# Altium project Reflow.PrjPcb
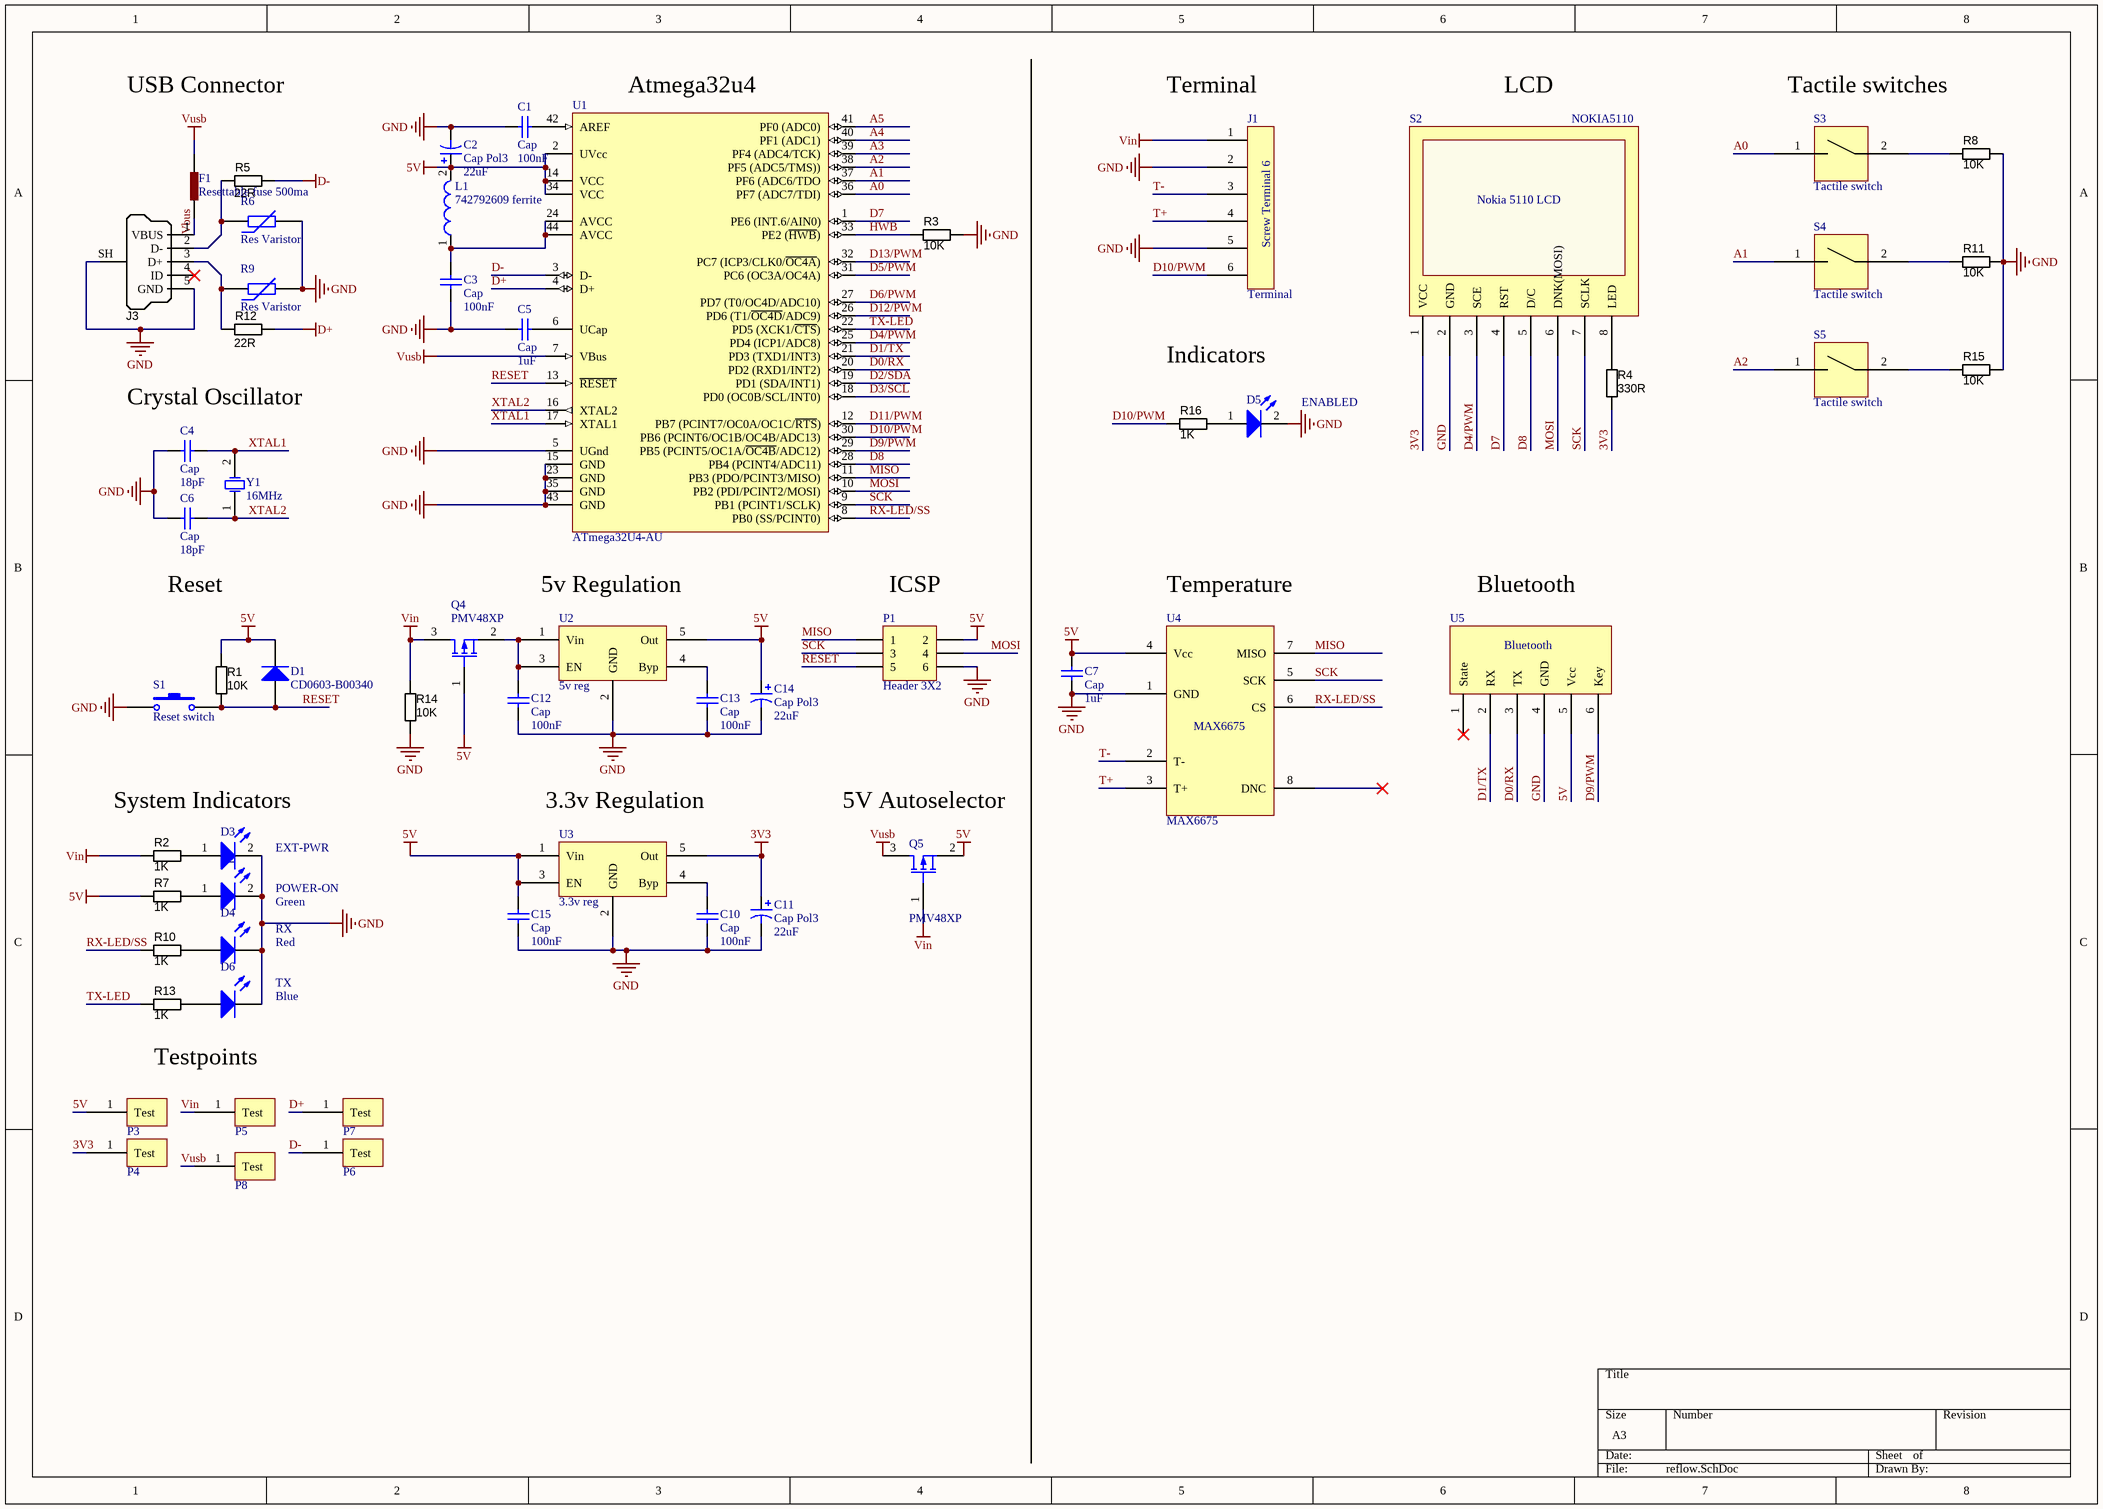
[diagram p0: reflow.SchDoc]
1 sheet, 59 parts. Net scope: global (net labels, ports and power ports of the same name join across sheets).
Board file: reflow.PcbDoc

## Sheet reflow.SchDoc
size A3

### Parts
C1  Cap  value 100nF  [CAP-0603-GEN]
C2  Cap Pol3  value 22uF  [CAP-0603-POL]
C3  Cap  value 100nF  [CAP-0603-GEN]
C4  Cap  value 18pF  [CAP-0603-GEN]
C5  Cap  value 1uF  [CAP-0603-GEN]
C6  Cap  value 18pF  [CAP-0603-GEN]
C7  Cap  value 1uF  [CAP-0603-GEN]
C10  Cap  value 100nF  [CAP-0603-GEN]
C11  Cap Pol3  value 22uF  [CAP-0603-POL]
C12  Cap  value 100nF  [CAP-0603-GEN]
C13  Cap  value 100nF  [CAP-0603-GEN]
C14  Cap Pol3  value 22uF  [CAP-0603-POL]
C15  Cap  value 100nF  [CAP-0603-GEN]
D1  CD0603-B00340  [DIODE-0603]
D2  POWER-ON  [LED-0603]
D3  EXT-PWR  [LED-0603]
D4  RX  [LED-0603]
D5  ENABLED  [LED-0603]
D6  TX  [LED-0603]
F1  Resettable fuse 500ma  [FUSE-0603]
J1  Terminal  [HEADER-3x2-RIGHT]
J3  USB Micro Type B (recommended if hand soldering)  [USB-MICRO-B]  (value not drawn)
L1  742792609 ferrite  [CAP-0603-GEN]
P1  Header 3X2  [TAG-CONNECT]
P3  TESTPOINT  [Testpoint]  (value not drawn)
P4  TESTPOINT  [Testpoint]  (value not drawn)
P5  TESTPOINT  [Testpoint]  (value not drawn)
P6  TESTPOINT  [Testpoint]  (value not drawn)
P7  TESTPOINT  [Testpoint]  (value not drawn)
P8  TESTPOINT  [Testpoint]  (value not drawn)
Q4  PMV48XP  [SOT23-3]
Q5  PMV48XP  [SOT23-3]
R1  value 10K  [RES-0603]  (hidden comment: Thick Film)
R2  value 1K  [RES-0603]  (hidden comment: Thick Film)
R3  value 10K  [RES-0603]  (hidden comment: Thick Film)
R4  value 330R  [RES-0603]  (hidden comment: Thick Film)
R5  value 22R  [RES-0603]  (hidden comment: Thick Film)
R6  Res Varistor  [RES-0603]
R7  value 1K  [RES-0603]  (hidden comment: Thick Film)
R8  value 10K  [RES-0603]  (hidden comment: Thick Film)
R9  Res Varistor  [RES-0603]
R10  value 1K  [RES-0603]  (hidden comment: Thick Film)
R11  value 10K  [RES-0603]  (hidden comment: Thick Film)
R12  value 22R  [RES-0603]  (hidden comment: Thick Film)
R13  value 1K  [RES-0603]  (hidden comment: Thick Film)
R14  value 10K  [RES-0603]  (hidden comment: Thick Film)
R15  value 10K  [RES-0603]  (hidden comment: Thick Film)
R16  value 1K  [RES-0603]  (hidden comment: Thick Film)
S1  Reset switch  [TACTILE-SWITCH]
S2  NOKIA5110  [NOKIA5110]
S3  Tactile switch  [TACTILE-SWITCH]
S4  Tactile switch  [TACTILE-SWITCH]
S5  Tactile switch  [TACTILE-SWITCH]
U1  ATmega32U4-AU  [44ML_N]
U2  5v reg  [SOT23-5]
U3  3.3v reg  [SOT23-5]
U4  MAX6675  [SO8_N]
U5  Bluetooth module  [BLUETOOTH-MODULE]  (value not drawn)
Y1  16MHz  [XTAL-5032]

### Nets
3V3: C11.1 P4.1(Test) R4.2 S2.1(VCC) U3.5(Out)
5V: C2.1 C7.2 C14.1 C15.2 D1.2(K) L1.2 P1.2 P3.1(Test) Q4.1(S) Q5.2(D) R1.2 R7.2 U1.2(UVcc) U1.14(VCC) U1.34(VCC) U2.5(Out) U3.1(Vin) U3.3(EN) U4.4(Vcc) U5.5(Vcc)
D+: P7.1(Test) R12.2 U1.4(D+)
D-: P6.1(Test) R5.2 U1.3(D-)
GND: C1.2 C2.2 C3.1 C4.2 C5.2 C6.2 C7.1 C10.1 C11.2 C12.1 C13.1 C14.2 C15.1 D2.2(K) D3.2(K) D4.2(K) D5.2(K) D6.2(K) J1.2 J1.5 J3.5(GND) J3.SH(Shell) P1.6 R3.1 R6.2 R8.1 R9.2 R11.1 R14.2 R15.1 S1.1 S2.2(GND) U1.5(UGnd) U1.15(GND) U1.23(GND) U1.35(GND) U1.43(GND) U2.2(GND) U3.2(GND) U4.1(GND) U5.4(GND)
Vin: J1.1 P5.1(Test) Q4.3(G) Q5.1(S) R2.2 R14.1
Vusb: F1.0 P8.1(Test) Q5.3(G) U1.7(VBus)
A0: S3.1 U1.36(PF7_(ADC7/TDI))
A1: S4.1 U1.37(PF6_(ADC6/TDO)
A2: S5.1 U1.38(PF5_(ADC5/TMS)))
A3: U1.39(PF4_(ADC4/TCK))
A4: U1.40(PF1_(ADC1))
A5: U1.41(PF0_(ADC0))
D0/RX: U1.20(PD2_(RXD1/INT2)) U5.3(TX)
D1/TX: U1.21(PD3_(TXD1/INT3)) U5.2(RX)
D2/SDA: U1.19(PD1_(SDA/INT1))
D3/SCL: U1.18(PD0_(OC0B/SCL/INT0))
D4/PWM: S2.3(SCE) U1.25(PD4_(ICP1/ADC8))
D5/PWM: U1.31(PC6_(OC3A/OC4A))
D6/PWM: U1.27(PD7_(T0/OC4D/ADC10))
D7: S2.4(RST) U1.1(PE6_(INT.6/AIN0))
D8: S2.5(D/C) U1.28(PB4_(PCINT4/ADC11))
D9/PWM: U1.29(PB5_(PCINT5/OC1A/~{OC4B}/ADC12)) U5.6(Key)
D10/PWM: J1.6 R16.2 U1.30(PB6_(PCINT6/OC1B/OC4B/ADC13))
D11/PWM: U1.12(PB7_(PCINT7/OC0A/OC1C/~{RTS}))
D12/PWM: U1.26(PD6_(T1/~{OC4D}/ADC9))
D13/PWM: U1.32(PC7_(ICP3/CLK0/~{OC4A}))
HWB: R3.2 U1.33(PE2_(~{HWB}))
MISO: P1.1 U1.11(PB3_(PDO/PCINT3/MISO)) U4.7(MISO)
MOSI: P1.4 S2.6(DNK(MOSI)) U1.10(PB2_(PDI/PCINT2/MOSI))
RESET: D1.1(A) P1.5 R1.1 S1.2 U1.13(~{RESET})
RX-LED/SS: R10.2 U1.8(PB0_(SS/PCINT0)) U4.6(CS)
SCK: P1.3 S2.7(SCLK) U1.9(PB1_(PCINT1/SCLK)) U4.5(SCK)
T+: J1.4 U4.3(T+)
T-: J1.3 U4.2(T-)
TX-LED: R13.2 U1.22(PD5_(XCK1/~{CTS}))
Vbus: F1.1 J3.1(VBUS)
XTAL1: C4.1 U1.17(XTAL1) Y1.2(OSC2)
XTAL2: C6.1 U1.16(XTAL2) Y1.1(OSC1)
NetC1_1: C1.1 U1.42(AREF)
NetC3_2: C3.2 L1.1 U1.24(AVCC) U1.44(AVCC)
NetC5_1: C5.1 U1.6(UCap)
NetC10_2: C10.2 U3.4(Byp)
NetC12_2: C12.2 Q4.2(D) U2.1(Vin) U2.3(EN)
NetC13_2: C13.2 U2.4(Byp)
NetD2_1: D2.1(A) R7.1
NetD3_1: D3.1(A) R2.1
NetD4_1: D4.1(A) R10.1
NetD5_1: D5.1(A) R16.1
NetD6_1: D6.1(A) R13.1
NetJ3_2: J3.2(D-) R5.1 R6.1
NetJ3_3: J3.3(D+) R9.1 R12.1
NetR4_1: R4.1 S2.8(LED)
NetR8_2: R8.2 S3.2
NetR11_2: R11.2 S4.2
NetR15_2: R15.2 S5.2

Not connected (* = marked no-connect by the designer): J3 4(ID)*; U4 8(DNC)*; U5 1(State)*

### Notes on the sheet
- USB Connector
- (near U1) Atmega32u4
- (near J1) Terminal
- LCD
- Tactile switches
- Indicators
- Crystal Oscillator
- Reset
- 5v Regulation
- (near P1) ICSP
- Temperature
- Bluetooth
- System Indicators
- (near U3) 3.3v Regulation
- (near Q5) 5V Autoselector
- Green
- Red
- Blue
- Testpoints
- (in symbol BLUETOOTH-MODULE) Bluetooth
- (in symbol NOKIA5110) Nokia 5110 LCD
- (in symbol SCREW-TERMINAL-6) Screw Terminal 6

### Library data of the parts
C1 C3-C7 C10 C12 C13 C15 = Cap: Capacitor; Published: 8-Jun-2000; LatestRevisionDate: 17-Jul-2002; LatestRevisionNote: Re-released for DXP Platform.; PackageReference: RAD-0.3; Publisher: Altium Limited; PackageDescription: Radial Cap, Thru-Hole; 2 Leads; 0.3 in Pin Spacing
C2 C11 C14 = Cap Pol3: Polarized Capacitor (Surface Mount); Published: 8-Jun-2000; LatestRevisionDate: 29-May-2009; LatestRevisionNote: IPC-7351 Footprint Added.; PackageReference: C0805; Publisher: Altium Limited; PackageDescription: Chip Capacitor
D1 = Diode: Default Diode; Published: 8-Jun-2000; LatestRevisionDate: 17-Jul-2002; LatestRevisionNote: Re-released for DXP Platform.; PackageVersion: Sep-1996; PackageReference: SMC; Publisher: Altium Limited; PackageDescription: DO-214-AB/SMC; 2 C-Bend Leads; Body 7.9 x 5.9 mm, inc. leads (LxW); Code_JEDEC: DO-214-AB
D2-D6 = LED2: Typical RED, GREEN, YELLOW, AMBER GaAs LED; Published: 8-Jun-2000; LatestRevisionDate: 17-Jul-2002; LatestRevisionNote: Re-released for DXP Platform.; PackageVersion: Feb-2002; PackageReference: 3.2X1.6X1.1; Publisher: Altium Limited; PackageDescription: SM LED; 2 Flat Leads
F1 = MF-MSMF: Bourns resettable fuse
J1 = SCREW-TERMINAL-6: Screw terminal
J3 = USB_Micro_TypeB_FCI: Connector SMD-THD USB Micro Type B middle mount; Manufacturer 1: FCI; Manufacturer Part Number 1: 10103593-0001LF; SCDType: undef; Package / Case: SMD/THD mid-mount; Supplier 1: Digi-Key; Supplier Part Number 1: 609-4049-1-ND
L1 = 742792609: SMD EMI Suppression Ferrite Bead WE-CBF, Z = 30 Ohm; Impedance: 30 Ohm; DatasheetVersion: Dec-2005; PackageVersion: 2009; PackageReference: SMD-0603; PackageDescription: Chip Inductor, 2-Leads, Body 1.6 x 0.8 mm; ComponentLink1Description: Manufacturer URL; ComponentLink1URL: http://www.we-online.com; ComponentLink2Description: Datasheet; ComponentLink2URL: http://www.we-online.de/katalog/media/pdf/742792609.pdf
P1 = Header 3X2: Header, 3-Pin, Dual row; LatestRevisionDate: 17-Jul-2002; LatestRevisionNote: Re-released for DXP Platform.; Publisher: Altium Limited
Q4 Q5 = MOSFET-P: P-Channel MOSFET; Published: 8-Jun-2000; LatestRevisionDate: 17-Jul-2002; LatestRevisionNote: Re-released for DXP Platform.; PackageVersion: 1995/1996; PackageReference: E3; Publisher: Altium Limited; PackageDescription: TO, Flat Index; 3 In-Line, Axial Leads; Body Dia. 4.6mm; Lead Dia. 0.5 mm (max)
R1-R5 R7 R8 R10-R16 = RES_820R_0603_1%: Resistor SMD chip 820 Ohm 0.1W 1% 0603; Manufacturer Part Number 1: RC0603FR-07820RL; Manufacturer 1: Yageo; Ratings: 1/10W; SCDType: undef; Package / Case: 0603 (1608 Metric); Supplier 1: Digi-Key; Supplier Part Number 1: 311-820HRCT-ND; Tolerance: ±1%
R6 R9 = Res Varistor: Varistor (Voltage-Sensitive Resistor); Published: 24-Mar-1999; LatestRevisionDate: 29-May-2009; LatestRevisionNote: IPC-7351 Footprint Added.; PackageVersion: Mar-2003; PackageReference: 6-0805; Publisher: Altium Limited; PackageDescription: Chip Resistor 0805 Case Size; Code_IPC: RESC2012
S1 = SW-PB: Switch; Published: 24-Mar-1999; LatestRevisionDate: 17-Jul-2002; LatestRevisionNote: Re-released for DXP Platform.; PackageReference: SPST-2; Publisher: Altium Limited; PackageDescription: Switch; 2 Leads
S3-S5 = TACTILE-SWITCH-2
U1 = ATmega32U4-AU: 8-bit AVR Microcontroller, 2.7-5.5V, 16MHz, 32KB Flash, 1KB EEPROM, 2.5KB SRAM, USB Controller, 44-pin TQFP, Industrial Grade (-40°C to 85°C), Ext Osc; DatasheetVersion: revF, Nov-2010; PackageVersion: rev.G, Jul-2007; PackageReference: 44ML; PackageDescription: 44-Pin Plastic Thin Quad Flat Pack, 10 x 10 x 1.0 mm Body, 0.8 mm Pitch (TQFP); ComponentLink1Description: Manufacturer URL; ComponentLink1URL: http://www.atmel.com/; ComponentLink2Description: ATmega16U4/32U4 Datasheet; ComponentLink2URL: http://www.atmel.com/dyn/resources/prod_documents/doc7766.pdf; ComponentLink3Description: ATmega16U4 ATmega32U4 Summary; ComponentLink3URL: http://www.atmel.com/dyn/resources/prod_documents/7766S.pdf
U2 U3 = SOT23-REG: Voltage regulator
U5 = BLUETOOTH-MODULE
Y1 = XTAL: Crystal Oscillator; Published: 8-Jun-2000; LatestRevisionDate: 17-Jul-2002; LatestRevisionNote: Re-released for DXP Platform.; PackageReference: R38; Publisher: Altium Limited; PackageDescription: Crystal, Thru-Hole; 2 Leads; Body 3.1 x 8.2 mm (Dia.xH)